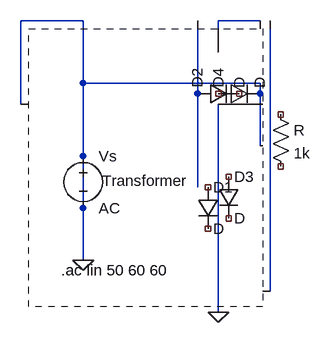
[diagram p0: schematic 05_circuit_generated-by-codex.asc]
05_circuit_generated-by-codex.asc, the LTspice schematic file:
Version 4
SHEET 1 880 680
WIRE -32 0 -128 0
WIRE 240 0 176 0
WIRE 176 48 176 0
WIRE -32 96 -32 0
WIRE 240 96 -32 96
WIRE -128 128 -128 0
WIRE 240 128 240 96
WIRE 176 176 176 128
WIRE 240 176 240 128
WIRE -32 192 -32 96
WIRE 240 192 240 176
WIRE -32 224 -32 192
WIRE 144 256 144 0
WIRE -32 288 -32 224
WIRE 256 288 256 0
WIRE -32 368 -32 288
WIRE 256 368 256 288
WIRE 176 416 176 176
WIRE 256 416 256 368
WIRE 176 448 176 416
FLAG 176 448 0
FLAG -32 368 0
SYMBOL Transformer -32 96 R0
SYMBOL diode 144 256 R0
SYMATTR InstName D1
SYMBOL diode 176 240 R0
SYMATTR InstName D3
SYMBOL diode 144 128 R270
SYMATTR InstName D2
SYMBOL diode 176 128 R270
SYMATTR InstName D4
SYMBOL res 256 128 R0
SYMATTR InstName R
SYMATTR Value 1k
SYMBOL voltage -32 192 R0
SYMATTR InstName Vs
SYMATTR Value AC
TEXT -66 384 Left 2 !.ac lin 50 60 60
.END

The netlist it stands for:
* 05_circuit_generated-by-codex.asc
* ?: Transformer (symbol Transformer not available, pin order unknown); nets seen at it: 0, N001, N002, N003
D1 NC_01 NC_02 D
D3 NC_03 NC_04 D
D2 N002 NC_05 D
D4 NC_06 0 D
R NC_07 NC_08 1k
Vs 0 0 AC
.model D D
.lib standard.dio
.ac lin 50 60 60
.backanno
.end